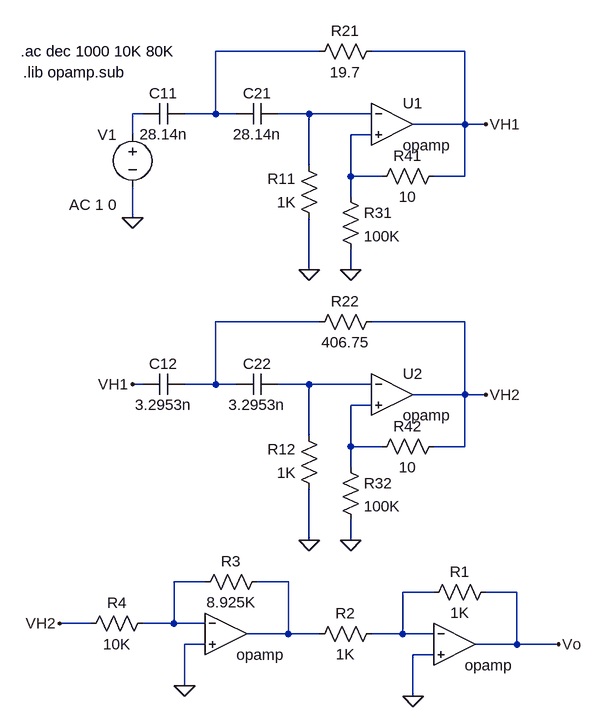
[diagram p0: schematic tp2_ej10.asc]
tp2_ej10.asc, the LTspice schematic file:
Version 4
SHEET 1 1568 1300
WIRE 80 48 -80 48
WIRE 304 48 160 48
WIRE -192 144 -208 144
WIRE -80 144 -80 48
WIRE -80 144 -128 144
WIRE -48 144 -80 144
WIRE 64 144 16 144
WIRE 160 144 64 144
WIRE 304 160 304 48
WIRE 304 160 224 160
WIRE 336 160 304 160
WIRE -208 176 -208 144
WIRE 160 176 128 176
WIRE 64 224 64 144
WIRE 128 240 128 176
WIRE 176 240 128 240
WIRE 304 240 304 160
WIRE 304 240 256 240
WIRE 128 272 128 240
WIRE -208 304 -208 256
WIRE 64 384 64 304
WIRE 128 384 128 352
WIRE 80 464 -80 464
WIRE 304 464 160 464
WIRE -192 560 -208 560
WIRE -80 560 -80 464
WIRE -80 560 -128 560
WIRE -48 560 -80 560
WIRE 64 560 16 560
WIRE 160 560 64 560
WIRE 304 576 304 464
WIRE 304 576 224 576
WIRE 336 576 304 576
WIRE 160 592 128 592
WIRE 64 640 64 560
WIRE 128 656 128 592
WIRE 176 656 128 656
WIRE 304 656 304 576
WIRE 304 656 256 656
WIRE 128 688 128 656
WIRE 64 800 64 720
WIRE 128 800 128 768
WIRE -96 864 -144 864
WIRE 32 864 -16 864
WIRE 256 880 208 880
WIRE 384 880 336 880
WIRE -272 928 -320 928
WIRE -144 928 -144 864
WIRE -144 928 -192 928
WIRE -96 928 -144 928
WIRE 32 944 32 864
WIRE 32 944 -32 944
WIRE 80 944 32 944
WIRE 208 944 208 880
WIRE 208 944 160 944
WIRE 256 944 208 944
WIRE -96 960 -128 960
WIRE 384 960 384 880
WIRE 384 960 320 960
WIRE 448 960 384 960
WIRE 256 976 224 976
WIRE -128 1024 -128 960
WIRE 224 1040 224 976
FLAG 128 384 0
FLAG 64 384 0
FLAG -208 304 0
FLAG 336 160 VH1
FLAG 128 800 0
FLAG 64 800 0
FLAG -208 560 VH1
FLAG 336 576 VH2
FLAG 448 960 Vo
FLAG 224 1040 0
FLAG -320 928 VH2
FLAG -128 1024 0
SYMBOL Opamps\\opamp 192 96 R0
SYMATTR InstName U1
SYMBOL cap -128 128 R90
WINDOW 0 0 32 VBottom 2
WINDOW 3 32 32 VTop 2
SYMATTR InstName C11
SYMATTR Value 28.14n
SYMBOL cap 16 128 R90
WINDOW 0 0 32 VBottom 2
WINDOW 3 32 32 VTop 2
SYMATTR InstName C21
SYMATTR Value 28.14n
SYMBOL res 176 32 R90
WINDOW 0 0 56 VBottom 2
WINDOW 3 32 56 VTop 2
SYMATTR InstName R21
SYMATTR Value 19.7
SYMBOL res 272 224 R90
WINDOW 0 0 56 VBottom 2
WINDOW 3 32 56 VTop 2
SYMATTR InstName R41
SYMATTR Value 10
SYMBOL res 112 256 R0
SYMATTR InstName R31
SYMATTR Value 100K
SYMBOL res 80 320 R180
WINDOW 0 36 76 Left 2
WINDOW 3 36 40 Left 2
SYMATTR InstName R11
SYMATTR Value 1K
SYMBOL voltage -208 160 M0
WINDOW 123 24 124 Left 2
WINDOW 39 0 0 Left 0
SYMATTR InstName V1
SYMATTR Value ""
SYMATTR Value2 AC 1 0
SYMBOL Opamps\\opamp 192 512 R0
SYMATTR InstName U2
SYMBOL cap -128 544 R90
WINDOW 0 0 32 VBottom 2
WINDOW 3 32 32 VTop 2
SYMATTR InstName C12
SYMATTR Value 3.2953n
SYMBOL cap 16 544 R90
WINDOW 0 0 32 VBottom 2
WINDOW 3 32 32 VTop 2
SYMATTR InstName C22
SYMATTR Value 3.2953n
SYMBOL res 176 448 R90
WINDOW 0 0 56 VBottom 2
WINDOW 3 32 56 VTop 2
SYMATTR InstName R22
SYMATTR Value 406.75
SYMBOL res 272 640 R90
WINDOW 0 0 56 VBottom 2
WINDOW 3 32 56 VTop 2
SYMATTR InstName R42
SYMATTR Value 10
SYMBOL res 112 672 R0
SYMATTR InstName R32
SYMATTR Value 100K
SYMBOL res 80 736 R180
WINDOW 0 36 76 Left 2
WINDOW 3 36 40 Left 2
SYMATTR InstName R12
SYMATTR Value 1K
SYMBOL Opamps\\opamp 288 896 R0
WINDOW 0 0 32 Invisible 2
SYMATTR InstName U3
SYMBOL res 352 864 R90
WINDOW 0 0 56 VBottom 2
WINDOW 3 32 56 VTop 2
SYMATTR InstName R1
SYMATTR Value 1K
SYMBOL res 176 928 R90
WINDOW 0 0 56 VBottom 2
WINDOW 3 32 56 VTop 2
SYMATTR InstName R2
SYMATTR Value 1K
SYMBOL Opamps\\opamp -64 880 R0
WINDOW 0 0 32 Invisible 2
SYMATTR InstName U4
SYMBOL res 0 848 R90
WINDOW 0 0 56 VBottom 2
WINDOW 3 32 56 VTop 2
SYMATTR InstName R3
SYMATTR Value 8.925K
SYMBOL res -176 912 R90
WINDOW 0 0 56 VBottom 2
WINDOW 3 32 56 VTop 2
SYMATTR InstName R4
SYMATTR Value 10K
TEXT -380 48 Left 2 !.ac dec 1000 10K 80K
TEXT -376 80 Left 2 !.lib opamp.sub

The netlist it stands for:
* tp2_ej10.asc
XU1 N003 N004 VH1 opamp Aol=100K GBW=10Meg  ; pins invin noninvin out
C11 N001 N002 28.14n
C21 N003 N001 28.14n
R21 VH1 N001 19.7
R41 VH1 N004 10
R31 N004 0 100K
R11 0 N003 1K
V1 N002 0 AC 1 0
XU2 N006 N007 VH2 opamp Aol=100K GBW=10Meg  ; pins invin noninvin out
C12 N005 VH1 3.2953n
C22 N006 N005 3.2953n
R22 VH2 N005 406.75
R42 VH2 N007 10
R32 N007 0 100K
R12 0 N006 1K
XU3 N010 0 Vo opamp Aol=100K GBW=10Meg  ; pins invin noninvin out
R1 Vo N010 1K
R2 N010 N009 1K
XU4 N008 0 N009 opamp Aol=100K GBW=10Meg  ; pins invin noninvin out
R3 N009 N008 8.925K
R4 N008 VH2 10K
.ac dec 1000 10K 80K
.lib opamp.sub
.backanno
.end